# EAGLE schematic Domino JTAG SPI (EAGLE 6.5.0)
DATABASE: ./../Common/BOM/Domino_DB.txt; DRAWN: M.STEMPIN; REV: A
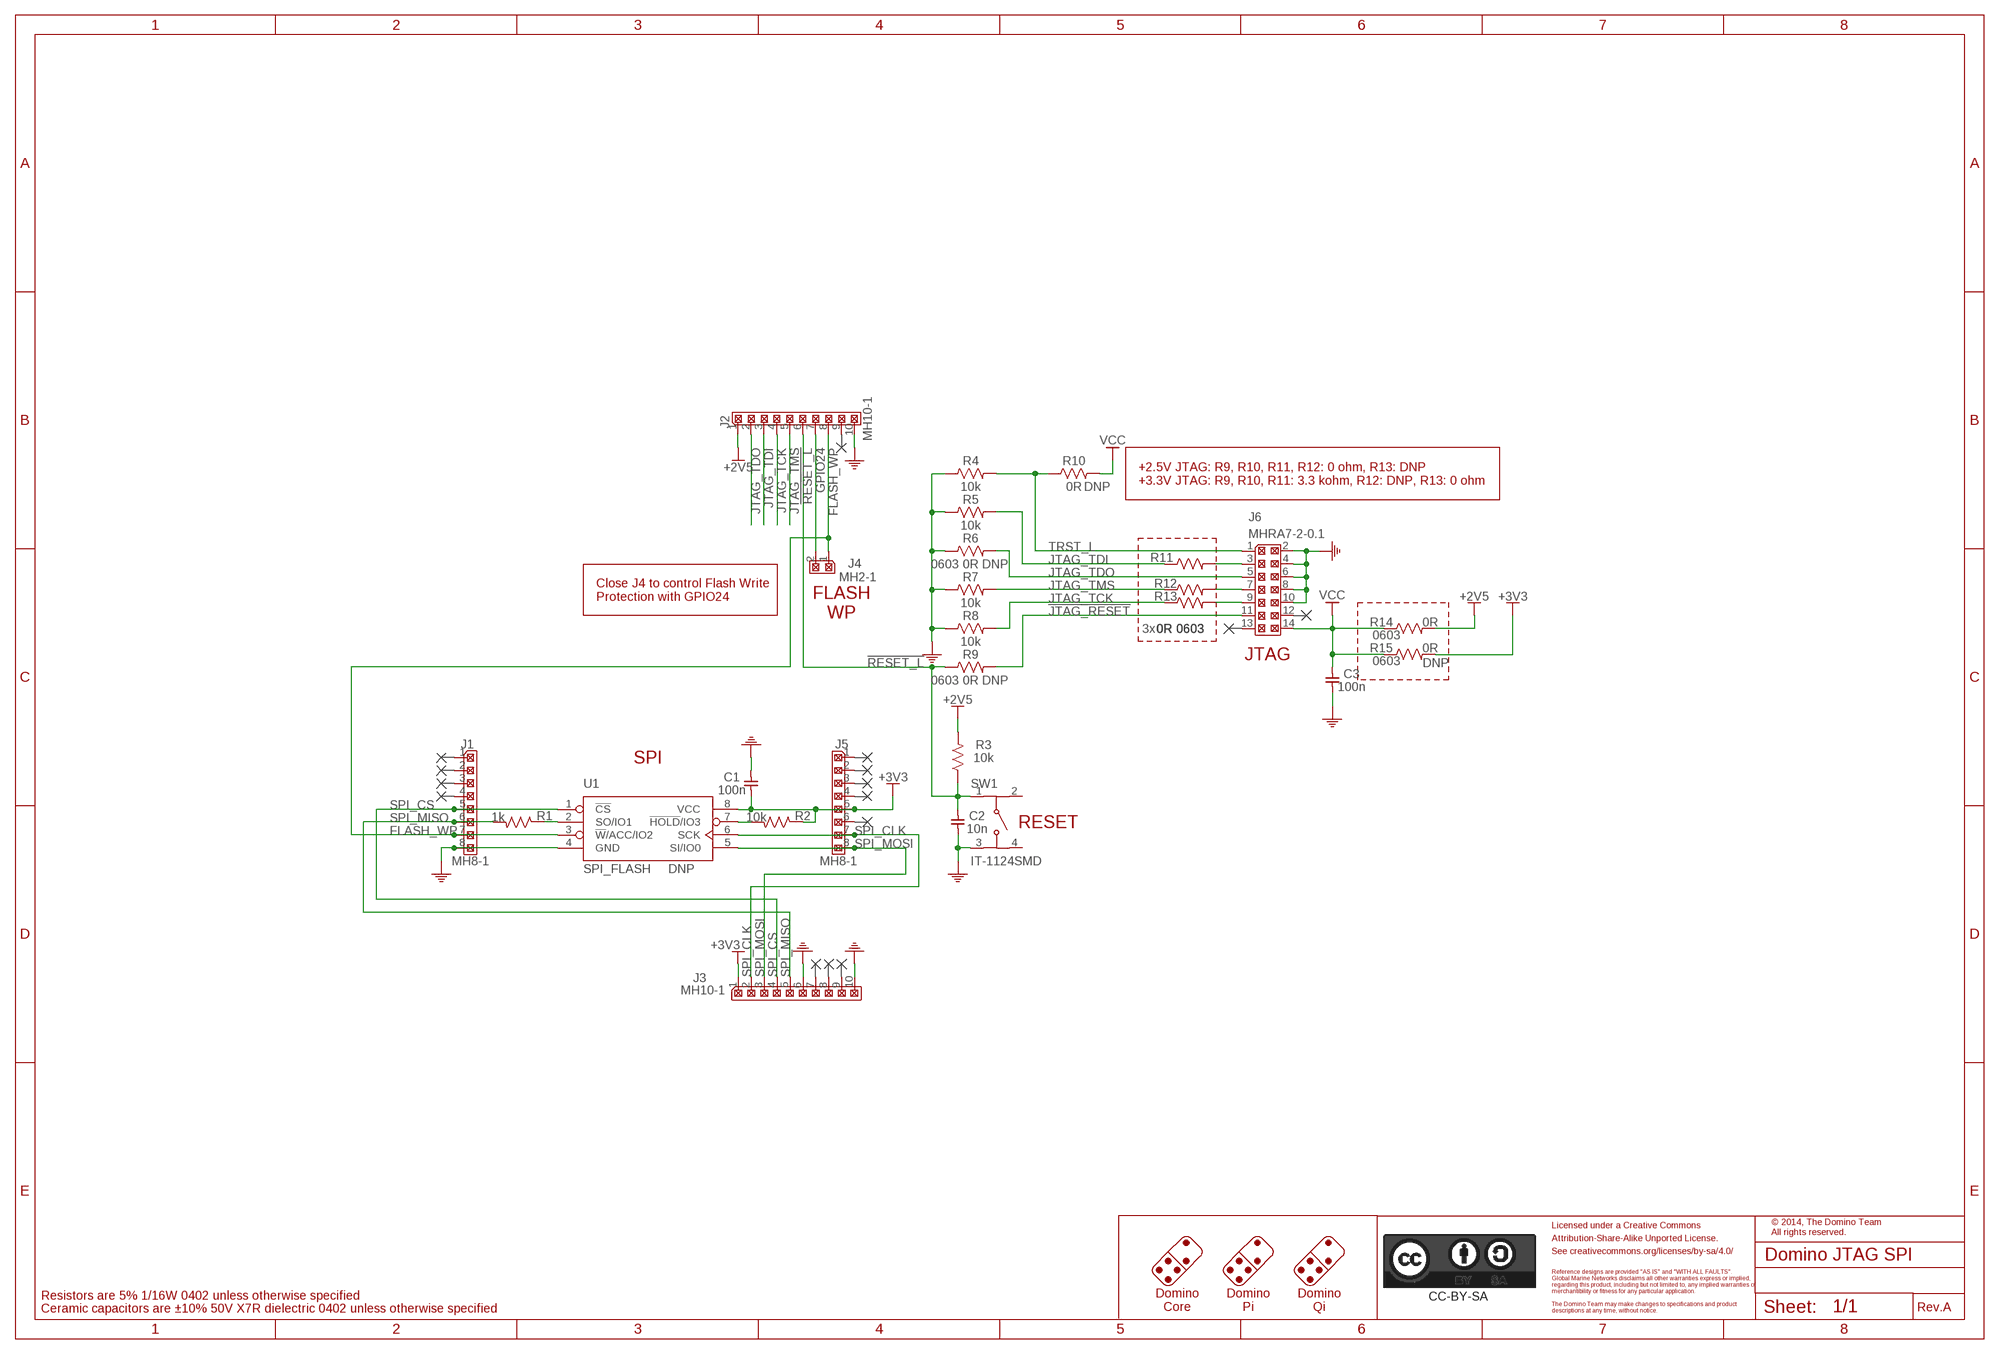
[diagram p0: schematic, sheet 1]
PORT1 (NC): BOM: EXCLUDE
PORT2 (NC): BOM: EXCLUDE
PORT3 (NC): BOM: EXCLUDE
PORT4 (NC): BOM: EXCLUDE
PORT5 (NC): BOM: EXCLUDE
PORT6 (NC): BOM: EXCLUDE
PORT7 (NC): BOM: EXCLUDE
PORT8 (NC): BOM: EXCLUDE
PORT9 (NC): BOM: EXCLUDE
PORT10 (NC): BOM: EXCLUDE
PORT11 (NC): BOM: EXCLUDE
PORT12 (NC): BOM: EXCLUDE
PORT13 (NC): BOM: EXCLUDE
PORT14 (NC): BOM: EXCLUDE
PORT15 (NC): BOM: EXCLUDE

## Parts
C1  100n  CAP_0402  [C0402]
C2  10n  CAP_0402  [C0402]
C3  100n  CAP_0402  [C0402]
CC-BY-SA1  CC-BY-SA_LOGO  [CC-BY-SA_LOGO]
J1  MH8-1  [MH8-1-0.1]
J2  MH10-1  [MH10-1-0.1]
J3  MH10-1  [MH10-1-0.1]
J4  MH2-1  [MH2-1-0.1]
J5  MH8-1  [MH8-1-0.1]
J6  MHRA7-2-0.1  [MHRA7-2-0.1]
R1  1k  RES_0402  [R0402]
R2  10k  RES_0402  [R0402]
R3  10k  RES_0402  [R0402]
R4  10k  RES_0402  [R0402]
R5  10k  RES_0402  [R0402]
R6  0R  RES_0603  [R0603]
R7  10k  RES_0402  [R0402]
R8  10k  RES_0402  [R0402]
R9  0R  RES_0603  [R0603]
R10  0R  RES_0603  [R0603]
R11  0R  RES_0603  [R0603]
R12  0R  RES_0603  [R0603]
R13  0R  RES_0603  [R0603]
R14  0R  RES_0603  [R0603]
R15  0R  RES_0603  [R0603]
SW1  IT-1124SMD  [IT-1124SMD]
U1  SPI_FLASH  [SOIC-8]

## Nets
!JTAG_RESET: J6.11 R9.2
!RESET_L: C2.1 J2.6 R3.1 R9.1 SW1.1
+2V5: J2.1 R3.2 R14.2
+3V3: C1.2 J3.1 J5.5 R2.1 R15.2 U1.8(VCC)
FLASH_WP: J1.7 J2.8 J4.1 U1.3(!W!/ACC/IO2)
GND: C1.1 C2.2 C3.2 J1.8 J2.10 J3.6 J3.10 J6.2 J6.4 J6.6 J6.8 J6.10 R4.1 R5.1 R6.1 R7.1 R8.1 SW1.3 U1.4(GND)
GPIO24: J2.7 J4.2
JTAG_TCK: J2.4 R8.2 R13.1
JTAG_TDI: J2.3 R5.2 R11.1
JTAG_TDO: J2.2 J6.5 R6.2
JTAG_TMS: J2.5 R7.2 R12.1
N$2: J6.7 R12.2
N$3: J6.9 R13.2
N$4: R2.2 U1.7(!HOLD!/IO3)
N$5: J6.3 R11.2
N$6: R1.1 U1.2(SO/IO1)
SPI_CLK: J3.2 J5.7 U1.6(SCK)
SPI_CS: J1.5 J3.4 U1.1(!CS)
SPI_MISO: J1.6 J3.5 R1.2
SPI_MOSI: J3.3 J5.8 U1.5(SI/IO0)
TRST_L: J6.1 R4.2 R10.1
VCC: C3.1 J6.14 R10.2 R14.1 R15.1
Unconnected: J1.1 J1.2 J1.3 J1.4 J2.9 J3.7 J3.8 J3.9 J5.1 J5.2 J5.3 J5.4 J5.6 J6.12 J6.13 SW1.2 SW1.4

## Notes on the sheet
- +2.5V JTAG: R9, R10, R11, R12: 0 ohm, R13: DNP
  +3.3V JTAG: R9, R10, R11: 3.3 kohm, R12: DNP, R13: 0 ohm
- Close J4 to control Flash Write
  Protection with GPIO24
- FLASH
  WP
- 3x
- JTAG
- SPI
- RESET
- Licensed under a Creative Commons
- © 2014, The Domino Team
  All rights reserved.
- Attribution-Share-Alike Unported License.
- See creativecommons.org/licenses/by-sa/4.0/
- Reference designs are provided "AS IS" and "WITH ALL FAULTS".
- Global Marine Networks disclaims all other warranties express or implied,
- regarding this product, including but not limited to, any implied warranties of
- merchantibility or fitness for any particular application.
- Resistors are 5% 1/16W 0402 unless otherwise specified
- Domino
  Core
- Domino
  Pi
- Domino
  Qi
- The Domino Team may make changes to specifications and product
- Ceramic capacitors are ±10% 50V X7R dielectric 0402 unless otherwise specified | descriptions at any time, without notice. | Rev.

## Library data of the parts
C1 C3 = Domino:CAP_: Capacitor; PARTNO: C0402_100n_X7R_10%_CER_50V; SIZE: 0402; TC: X7R; TOL: ±10%; TYPE: CER; VOLT: 50V
C2 = Domino:CAP_: Capacitor; PARTNO: C0402_10n_X7R_10%_CER_50V; SIZE: 0402; TC: X7R; TOL: ±10%; TYPE: CER; VOLT: 50V
CC-BY-SA1 = Domino:CC-BY-SA_LOGO: Attribution-Share-Alike Unported License See creativecommons.org/licenses/by-sa/3.0/ for details.; BOM: EXCLUDE
J1 J5 = Domino:MH8-1: 8x1 Pin Male Header; PARTNO: MH8-1-0.1
J2 J3 = Domino:MH10-1: 10x1 Pin Male Header; PARTNO: MH10-1-0.1
J4 = Domino:MH2-1: 2x1 Pin Male Header; PARTNO: MH2-1-0.1
J6 = Domino:MHRA7-2-0.1: 2x14 Pin Male Header Right Angle with Sleeve, 0.1" Pitch; PARTNO: MHRA7-2-0.1
R1 = Domino:RES_: Resistor; PARTNO: R0402_1k_5%_62.5mW; RATE: 62.5mW; SIZE: 0402; TOL: 5%
R2-R5 R7 R8 = Domino:RES_: Resistor; PARTNO: R0402_10k_5%_62.5mW; RATE: 62.5mW; SIZE: 0402; TOL: 5%
R6 R9 R10 R15 = Domino:RES_: Resistor; DNP: T; PARTNO: R0603_0R_5%_125mW; RATE: 125mW; SIZE: 0603; TOL: 5%
R11-R14 = Domino:RES_: Resistor; PARTNO: R0603_0R_5%_125mW; RATE: 125mW; SIZE: 0603; TOL: 5%
SW1 = Domino:IT-1124SMD: SPST Tact Switch; PARTNO: IT-1124SMD
U1 = Domino:SPI_FLASH: SPI Flash Memory Footprint; DNP: T; PARTNO: SPI_FLASH

## Net classes
1 USB: width 0.254 mm, clearance 0.127 mm
2 PoE: width 0.61 mm, clearance 0.13 mm to class 0, clearance 0.13 mm to class 1, clearance 0.13 mm